# Altium project PoC_PCB.PrjPcb
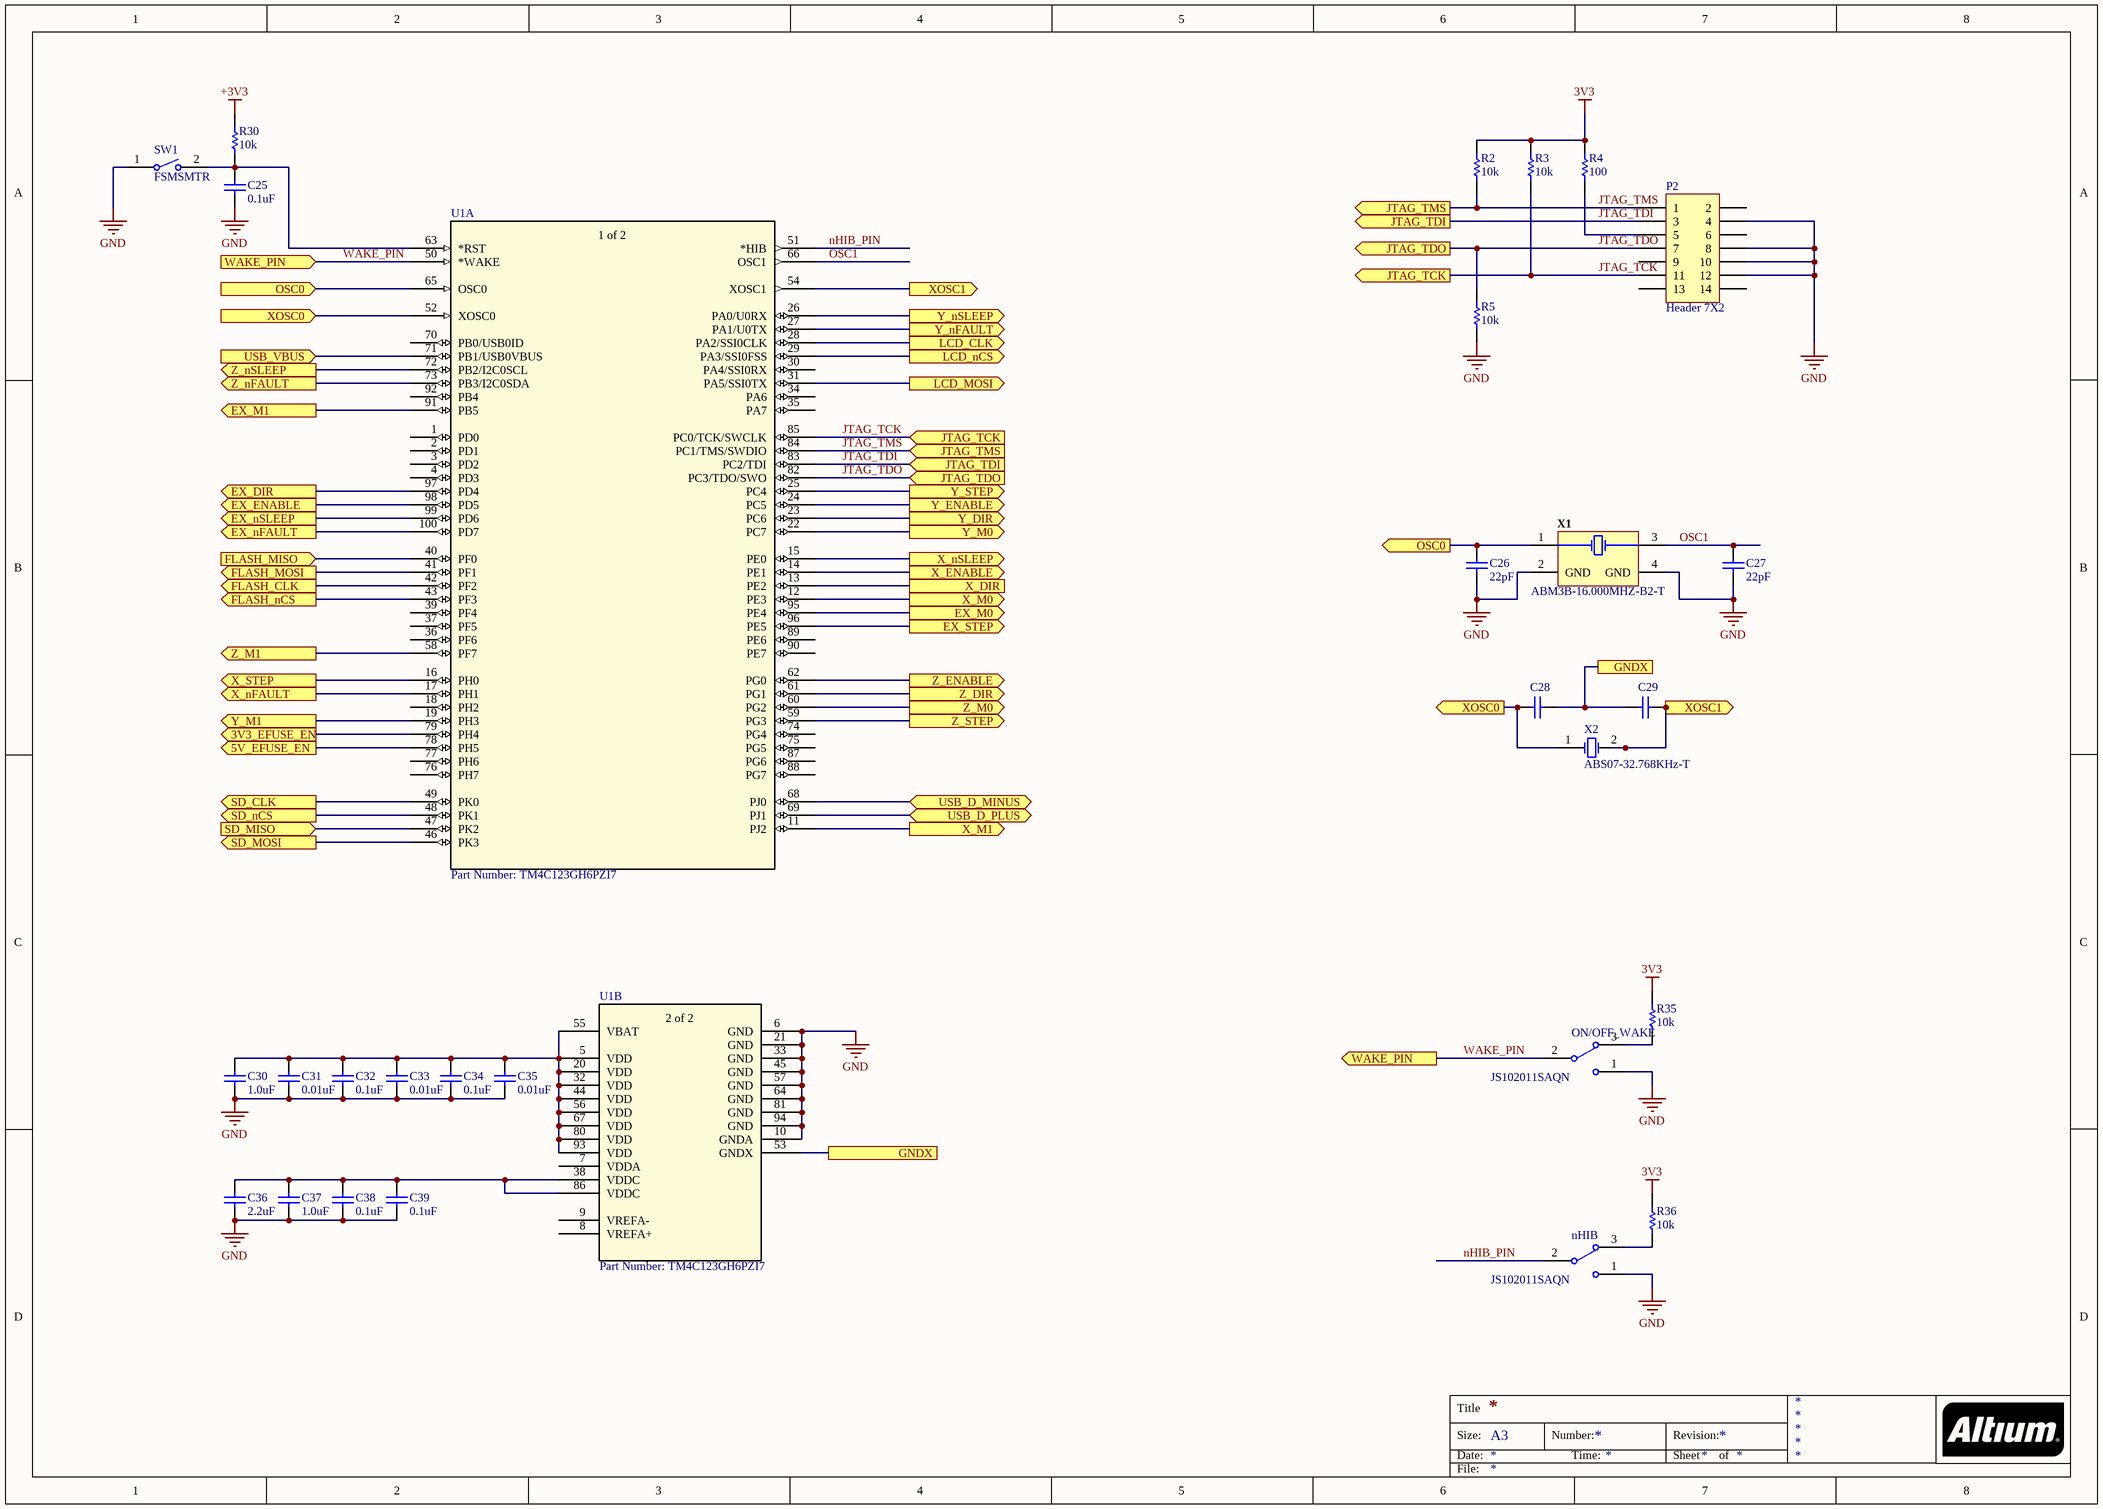
[diagram p0: MCU.SchDoc]
6 sheets, 123 parts. Net scope: flat (ports and power ports of the same name join across sheets).
Board file: PoC.PcbDoc
Sheets:
  MCU.SchDoc
  Memory_USB.SchDoc
  Power.SchDoc
  X_Y_Motor_Drivers.SchDoc
  Z_Extruder_Motor_Drivers.SchDoc
  LCD.SchDoc

## Sheet MCU.SchDoc
size A3

### Parts
C25  0.1uF  [CAPC1608X90X35ML10T15]
C26  22pF  [CAPC1608X90X35ML10T15]
C27  22pF  [CAPC1608X90X35ML10T15]
C28  GRM1885C1H120JA01D  [CAPC1608X90X35ML10T15]  (value not drawn)
C29  GRM1885C1H120JA01D  [CAPC1608X90X35ML10T15]  (value not drawn)
C30  1.0uF  [CAPC1608X60X35NL10T15]
C31  0.01uF  [CAPC1608X87X35ML15T15]
C32  0.1uF  [CAPC1608X90X35ML10T15]
C33  0.01uF  [CAPC1608X87X35ML15T15]
C34  0.1uF  [CAPC1608X90X35ML10T15]
C35  0.01uF  [CAPC1608X87X35ML15T15]
C36  2.2uF  [CAPC1608X90X35ML10T15]
C37  1.0uF  [CAPC1608X60X35NL10T15]
C38  0.1uF  [CAPC1608X90X35ML10T15]
C39  0.1uF  [CAPC1608X90X35ML10T15]
nHIB  JS102011SAQN  [CKCP-JS102011SAQN-3_V]
ON/OFF_WAKE  JS102011SAQN  [CKCP-JS102011SAQN-3_V]
P2  Header 7X2  [HDR2X7]
R2  10k  [RESC1608X55X30LL15T15]
R3  10k  [RESC1608X55X30LL15T15]
R4  100  [RESC1608X55X30LL15T15]
R5  10k  [RESC1608X55X30LL15T15]
R30  10k  [RESC1608X55X30LL15T15]
R35  10k  [RESC1608X55X30LL15T15]
R36  10k  [RESC1608X55X30LL15T15]
SW1  FSMSMTR  [TECO-FSMSMTR_V]
U1  Part Number: TM4C123GH6PZI7  [PZ100]  (parts A,B of 2)
X1  ABM3B-16.000MHZ-B2-T  [ABRA-ABM3B-4_V]
X2  ABS07-32.768KHz-T  [ABRA-ABS07-2_V]

### Ports
3V3_EFUSE_EN (out), 5V_EFUSE_EN (out), EX_DIR (out), EX_ENABLE (out), EX_M0 (out), EX_M1 (out), EX_nFAULT (out), EX_nSLEEP (out), EX_STEP (out), FLASH_CLK (out), FLASH_MISO (in), FLASH_MOSI (out), FLASH_nCS (out), GNDX, JTAG_TCK (in), JTAG_TCK (out), JTAG_TDI (in), JTAG_TDI (out), JTAG_TDO (in), JTAG_TDO (out), JTAG_TMS (in), JTAG_TMS (out), LCD_CLK (out), LCD_MOSI (out), LCD_nCS (out), OSC0 (in), OSC0 (out), SD_CLK (out), SD_MISO (in), SD_MOSI (out), SD_nCS (out), USB_D_MINUS (bidir), USB_D_PLUS (bidir), USB_VBUS (in), WAKE_PIN (in), WAKE_PIN (out), X_DIR, X_ENABLE (out), X_M0 (out), X_M1 (out), X_nFAULT (out), X_nSLEEP (out), X_STEP (out), XOSC0 (in), XOSC0 (out), XOSC1 (out), Y_DIR (out), Y_ENABLE (out), Y_M0 (out), Y_M1 (out), Y_nFAULT (out), Y_nSLEEP (out), Y_STEP (out), Z_DIR (out), Z_ENABLE (out), Z_M0 (out), Z_M1 (out), Z_nFAULT (out), Z_nSLEEP (out), Z_STEP (out)

### Nets
3V3: R2.2 R3.2 R4.2 R35.2 R36.2
+3V3: R30.2
GND: C25.1 C26.1 C27.1 C30.1 C31.1 C32.1 C33.1 C34.1 C35.1 C36.1 C37.1 C38.1 C39.1 nHIB.1 ON/OFF_WAKE.1 P2.4 P2.8 P2.10 P2.12 R5.1 SW1.1 U1.6(GND) U1.10(GNDA) U1.21(GND) U1.33(GND) U1.45(GND) U1.57(GND) U1.64(GND) U1.81(GND) U1.94(GND) X1.2(GND) X1.4(GND)
EX~{_}SLEEP: U1.99(PD6) ; port EX_nSLEEP
EX_DIR: U1.97(PD4) ; port EX_DIR
EX_ENABLE: U1.98(PD5) ; port EX_ENABLE
EX_M0: U1.95(PE4) ; port EX_M0
EX_M1: U1.91(PB5) ; port EX_M1
EX_nFAULT: U1.100(PD7) ; port EX_nFAULT
EX_STEP: U1.96(PE5) ; port EX_STEP
FLASH_Clk: U1.42(PF2) ; port FLASH_CLK
FLASH_MISO: U1.40(PF0) ; port FLASH_MISO
FLASH_MOSI: U1.41(PF1) ; port FLASH_MOSI
FLASH_nCS: U1.43(PF3) ; port FLASH_nCS
JTAG_TCK: P2.11 R3.1 U1.85(PC0/TCK/SWCLK) ; port JTAG_TCK
JTAG_TDI: P2.3 U1.83(PC2/TDI) ; port JTAG_TDI
JTAG_TDO: P2.7 R5.2 U1.82(PC3/TDO/SWO) ; port JTAG_TDO
JTAG_TMS: P2.1 R2.1 U1.84(PC1/TMS/SWDIO) ; port JTAG_TMS
nHIB_PIN: nHIB.2 U1.51(*HIB)
OSC1: C27.2 U1.66(OSC1) X1.3(X2)
SD_Clock: U1.49(PK0) ; port SD_CLK
SD_Data_In: U1.46(PK3) ; port SD_MOSI
SD_Data_Out: U1.47(PK2) ; port SD_MISO
SD_nCS: U1.48(PK1) ; port SD_nCS
WAKE_PIN: ON/OFF_WAKE.2 U1.50(*WAKE) ; port WAKE_PIN
X~{_}SLEEP: U1.15(PE0) ; port X_nSLEEP
X_DIR: U1.13(PE2) ; port X_DIR
X_ENABLE: U1.14(PE1) ; port X_ENABLE
X_M0: U1.12(PE3) ; port X_M0
X_M1: U1.11(PJ2) ; port X_M1
X_nFAULT: U1.17(PH1) ; port X_nFAULT
X_STEP: U1.16(PH0) ; port X_STEP
Y~{_}SLEEP: U1.26(PA0/U0RX) ; port Y_nSLEEP
Y_DIR: U1.23(PC6) ; port Y_DIR
Y_ENABLE: U1.24(PC5) ; port Y_ENABLE
Y_M0: U1.22(PC7) ; port Y_M0
Y_M1: U1.19(PH3) ; port Y_M1
Y_nFAULT: U1.27(PA1/U0TX) ; port Y_nFAULT
Y_STEP: U1.25(PC4) ; port Y_STEP
Z~{_}SLEEP: U1.72(PB2/I2C0SCL) ; port Z_nSLEEP
Z_DIR: U1.61(PG1) ; port Z_DIR
Z_ENABLE: U1.62(PG0) ; port Z_ENABLE
Z_M0: U1.60(PG2) ; port Z_M0
Z_M1: U1.58(PF7) ; port Z_M1
Z_nFAULT: U1.73(PB3/I2C0SDA) ; port Z_nFAULT
Z_STEP: U1.59(PG3) ; port Z_STEP
NetC25_2: C25.2 R30.1 SW1.2 U1.63(*RST)
NetC26_2: C26.2 U1.65(OSC0) X1.1(X1) ; port OSC0
NetC28_1: C28.1 U1.52(XOSC0) X2.1(X1) ; port XOSC0
NetC28_2: C28.2 C29.1 U1.53(GNDX) ; port GNDX
NetC29_2: C29.2 U1.54(XOSC1) X2.2(X2) ; port XOSC1
NetC30_2: C30.2 C31.2 C32.2 C33.2 C34.2 C35.2 U1.5(VDD) U1.20(VDD) U1.32(VDD) U1.44(VDD) U1.55(VBAT) U1.56(VDD) U1.67(VDD) U1.80(VDD) U1.93(VDD)
NetC36_2: C36.2 C37.2 C38.2 C39.2 U1.38(VDDC) U1.86(VDDC)
NetJ1_2: U1.68(PJ0) ; port USB_D_MINUS
NetJ1_3: U1.69(PJ1) ; port USB_D_PLUS
NetLCD_J2_1: U1.29(PA3/SSI0FSS) ; port LCD_nCS
NetLCD_J2_3: U1.28(PA2/SSI0CLK) ; port LCD_CLK
NetLCD_J2_4: U1.31(PA5/SSI0TX) ; port LCD_MOSI
NetnHIB_3: nHIB.3 R36.1
NetON/OFF_WAKE_3: ON/OFF_WAKE.3 R35.1
NetP2_5: P2.5 R4.1
NetR31_1: U1.71(PB1/USB0VBUS) ; port USB_VBUS
NetU1_78: U1.78(PH5) ; port 5V_EFUSE_EN
NetU1_79: U1.79(PH4) ; port 3V3_EFUSE_EN

Not connected (* = marked no-connect by the designer): P2 2 6 9 13 14; U1 1(PD0) 2(PD1) 3(PD2) 4(PD3) 7(VDDA) 8(VREFA+) 9(VREFA-) 18(PH2) 30(PA4/SSI0RX) 34(PA6) 35(PA7) 36(PF6) 37(PF5) 39(PF4) 70(PB0/USB0ID) 74(PG4) 75(PG5) 76(PH7) 77(PH6) 87(PG6) 88(PG7) 89(PE6) 90(PE7) 92(PB4)

### Notes on the sheet
- Title
- Size:
- Date:
- A3
- Number:
- Time:
- Revision:
- Sheet
- of
- File:
- (in symbol TM4C123GH6PZI7, part A) 1 of 2
- (in symbol TM4C123GH6PZI7, part B) 2 of 2

### Library data of the parts
C25 C32 C34 C38 C39 = CMP-2100-03643-1: Chip Capacitor, 0.1 uF, +/- 10%, 50 V, -55 to 125 degC, 0603 (1608 Metric), RoHS, Tape and Reel; Manufacturer: Murata; Dielectric Material: Ceramic; Voltage Rating: 50V; Capacitance: 100nF; Dielectric: X7R; Insulation Resistance: 10GR; Case Code (Metric): 1608; Lead Free: LeadFree; Depth: 0.8mm; Number of Pins: 2; Radiation Hardening: No; Case/Package: 0603; Manufacturer URL: http://www.murata.com/; Packaging: TapeandReel; Length: 1.6mm; Contact Plating: Tin; Datasheet URL: http://psearch.en.murata.com/capacitor/product/GRM188R71H104KA93%23.pdf; Tolerance: 10%; Case Code (Imperial): 0603; Min Operating Temperature: -55degC; RoHSCompliant: true; Voltage: 50V; Termination: SMD/SMT; Mount: SurfaceMount; Material: Ceramic; Package Quantity: 1; Height: 0.8mm; Thickness: 0.035inch; REACH SVHC: NoSVHC; Max Operating Temperature: 125degC; Width: 0.8mm; Package Reference: 0603; Voltage Rating (DC): 50V; Datasheet Version: 42675.0; Package Description: 2-Pin Surface Mount Device, Body 1.6 x 0.8 mm
C26 C27 = CMP-2006-02602-1: Part Number: GRM1885C1H120JA01D; Manufacturer: Murata
C28 C29 = CMP-2006-02602-1: Manufacturer: Murata; Part Number: GRM1885C1H120JA01D
C30 C37 = CMP-2006-00116-1: Manufacturer: Murata; Part Number: GRM185R61C105KE44J
C31 C33 C35 = CMP-2006-03042-1: Part Number: C0603C103K4RACTU; Manufacturer: Kemet
C36 = CMP-2006-02836-1: Manufacturer: Murata; Part Number: GRM188R71A225KE15D
nHIB ON/OFF_WAKE = CMP-2000-06501-1: Sub-Miniature Slide Switch, SPDT, -40 to 85 degC, 3-Pin SMD, RoHS, Tape and Reel; Manufacturer: C&K Components; Electrical Life: 15000Cycles; Actuator Color: Black; Body Orientation: RightAngle; Minimum Insulation Resistance: 100MOhm; Contact Rating @ Voltage: 0.3@6VDCA; Actuator Style: SideSlide; Maximum DC Voltage Rating: 6V; COO: US; Actuator Material: Nylon4/6; Dielectric Strength: 500VAC; Maximum Contact Resistance: 70mOhm; Base Material: N/A; Mounting Technology: SurfaceMount; Switch Configuration: N/A; Package Reference: SMT; Package Description: 3-Pin Surface Mount Device, Body 9 x 3.6 mm, Height 3.5 mm; Mounting: SurfaceMount,GullWing; Part No: JS102011SAQN; Dimension: 9x4.3mm; Type: Sub-Miniature; Product Weight: N/A; Seal Location: N/A; Family: JS; ECCN: EAR99; Supplier: C&KComponents; Seal Description: N/A; Contact Plating: Silver; Pole Throw Configuration: SPDT; Packaging: TapeandReel; Manufacturer URL: http://www.ckswitches.com/; Datasheet URL: https://datasheet.ciiva.com/1532/js-9dec14-1532400.pdf; Maximum AC Voltage Rating: N/A; Mechanical Life: N/A; HTS: 8536509050; Datasheet Version: 12/2014; Housing Material: Nylon4/6; Contact Material: CopperAlloy; RoHS: Yes; Operating Temperature: -40to85C
P2 = Header 7X2: Header, 7-Pin, Dual row; LatestRevisionDate: 17-Jul-2002; LatestRevisionNote: Re-released for DXP Platform.; Publisher: Altium Limited
R2-R5 R30 R35 R36 = CMP-2000-00181-1: Part Number: ERJ-3EKF1002V; Manufacturer: Panasonic
SW1 = CMP-2000-07501-1: FSMSM Push Button Switch, 50 mA, -35 to 85 degC, 2-Pin SMD, RoHS, Tape and Reel; Manufacturer: TE Connectivity; Voltage Rating (DC): 24V; Electrical Life: 20000Cycles; Operating Force: 180gf; Switch Travel: 0.25mm; Contact Current Rating: 50mA; Case\/Package: SMD/SMT; Actuator Length: 1.07mm; Throw Configuration: SPST; Actuator Material: Polyamide; Contact Resistance: 100mOhm; Illumination Type: Illuminated; Max Voltage Rating (DC): 12V; Manufacturer URL: http://www.te.com/; Lead Free: LeadFree; Packaging: TapeandReel; Min Operating Temperature: -35degC; Mechanical Life: 20000Cycles; Mount: SurfaceMount; REACH SVHC: Unknown; Package Quantity: 1800; Package Reference: FSMSMTR; RoHSCompliant: true; Max Operating Temperature: 85degC; Orientation: Straight; ELV: Compliant; Datasheet URL: http://www.te.com/commerce/DocumentDelivery/DDEController?Action=showdoc&DocId=Customer+Drawing%7F1437566-3%7FC2%7Fpdf%7FEnglish%7FENG_CD_1437566-3_C2_1437566_3_1_c.dwg.pdf%7F1437566-4; Package Description: 2-Pin Surface Mount Device, Body 6 x 3.5 mm, Pitch 9.19 mm; Current Rating: 50mA; Contact Plating: Silver; Termination: GullWing; Datasheet Version: Rev. C2, 08/2014; Contact Material: Brass; Mounting Technology: SurfaceMount
U1 = TM4C123GH6PZI7: No Description Available; Built_By: EMA_UL_Team; Vendor: Texas Instruments; Manufacturer_Part_Number: TM4C123GH6PZI7; Copyright: Copyright (C) 2018 Accelerated Designs. All rights reserved; RefDes: RefDes; Type: DEV; Value: Value
X1 = CMP-1688-00003-1: Ceramic SMD Crystal, 16 MHz, +/- 20 ppm, 50 Ohm, -20 to 70 degC, 4-Pin SMD, RoHS, Tape and Reel; Current Rating: 1.82 A; Resistance: 0.033 Ohm; Tolerance: 30%; Shielding: Shielded; REACH SVHC: Unknown; RoHSCompliant: True; PackageReference: ABM3B; Mount: Surface Mount; Max Operating Temperature: 105degC; DatasheetVersion: Aug-15; Package Quantity: 500; PackageDescription: 4-Pin Surface Mount Device, Body 5 x 3.2 mm; ComponentLink2URL: http://www.abracon.com/Resonators/abm3b.pdf; Packaging: Tape and Reel; Height: 2.8 mm; ComponentLink1URL: http://www.abracon.com/; ComponentLink2Description: Datasheet; Length: 0.197 inch; ComponentLink1Description: Manufacturer URL; Case/Package: 5028; Width: 0.197 inch; Min Operating Temperature: -40degC
X2 = CMP-0447-00001-2: Crystal, 32.768 kHz, 12.5 pF, -40 to 85 degC, SMD Low Profile 3.2 x 1.5 x 0.9 mm, Tape and Reel; Manufacturer: Abracon; Q Value (Type): 30000; Operation Mode: Flexural Mode (Tuning Fork); Shunt Capacitance (C0): 0.9 to 1.2 pF; Load Capacitance (CL): 12.5 pF; Frequency Tolerance @+25degC: +/- 20 ppm; Drive Level (Type): 0.1 uW; Equivalent Series Resistance (R1): 70 Kohm; Insulation Resistance (Min): 500 Mohm; ComponentLink3URL: http://www.abracon.com/Resonators/ABS07.pdf; PackageDescription: 2-Pin Hand Drawn, Body 3.2x1.5mm, Pitch 2.5mm; Operating Temperature: -40 to 85 degC; ComponentLink2URL: http://www.abracon.com/Resonators/ABS07.pdf; PackageReference: ABS07-2; ComponentLink3Description: Package Specification; ComponentLink1Description: Manufacturer URL; DatasheetVersion: 04.03.13; Mounting Technology: Surface Mount; ComponentLink2Description: Datasheet; ComponentLink1URL: http://www.abracon.com/; PartNumber: ABS07-32.768KHz-T; Packing: Tape and Reel; Frequency: 32.768 kHz

## Sheet Memory_USB.SchDoc
size A
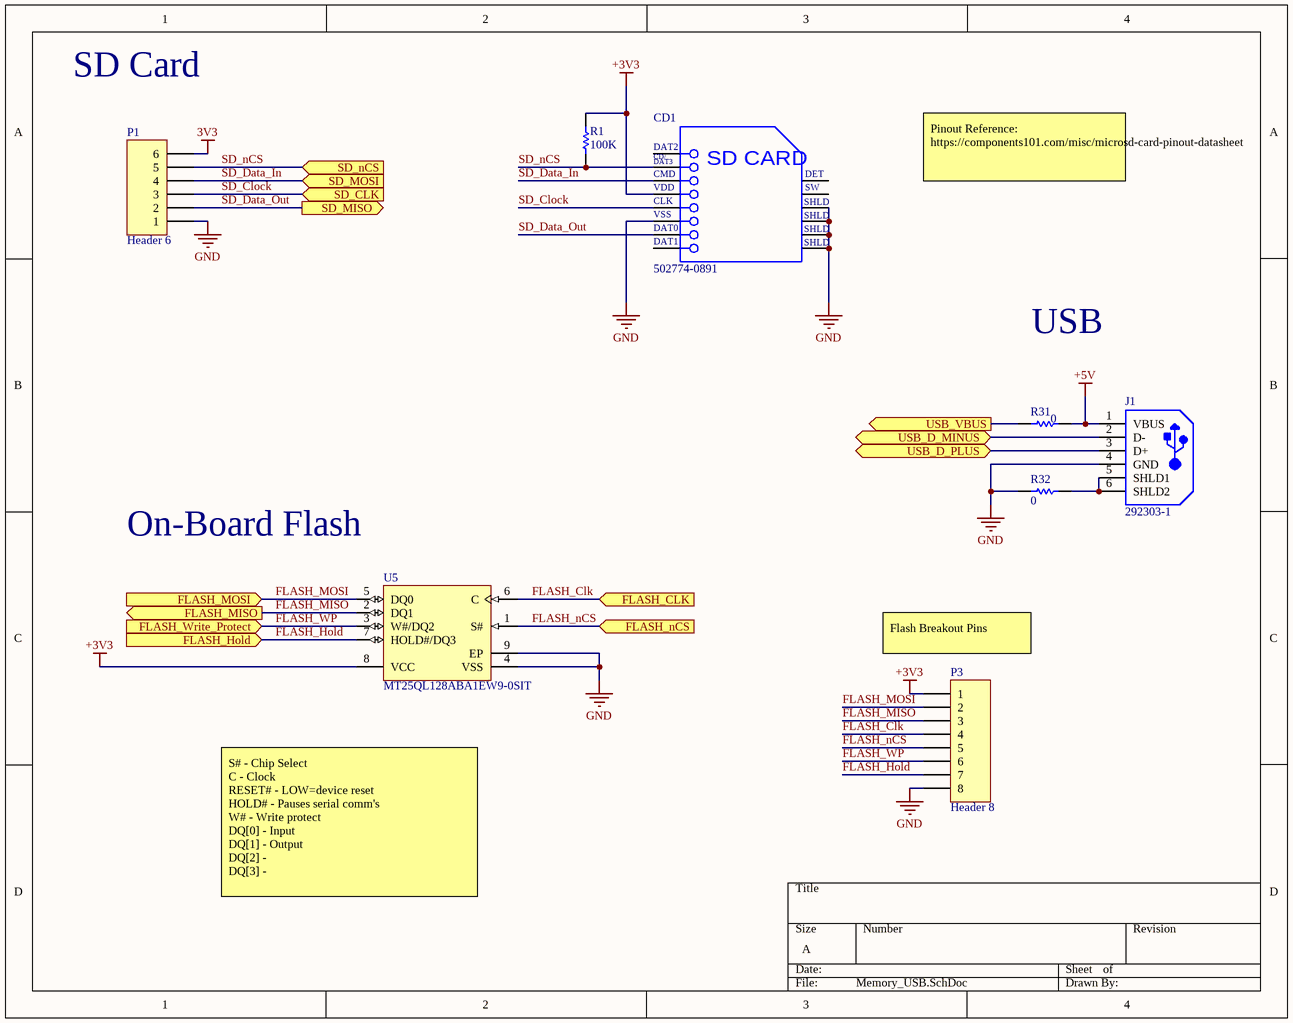
[diagram p1: Memory_USB.SchDoc]

### Parts
CD1  502774-0891  [MOLX-502774-0891_V]
J1  292303-1  [TE-292303-1_V]
P1  Header 6  [HDR1X6]
P3  Header 8  [HDR1X8]
R1  100K  [RESC1608X55X25ML10T15]
R31  0  [RESC1608X55X25ML10T15]
R32  0  [RESC1608X55X25ML10T15]
U5  MT25QL128ABA1EW9-0SIT  [MICT-W9-8_L]

### Ports
FLASH_CLK (in), FLASH_Hold (in), FLASH_MISO (out), FLASH_MOSI (in), FLASH_nCS (in), FLASH_Write_Protect (in), SD_CLK (in), SD_MISO (out), SD_MOSI (in), SD_nCS (in), USB_D_MINUS (bidir), USB_D_PLUS (bidir), USB_VBUS (out)

### Nets
3V3: P1.6
+3V3: CD1.4(VDD) P3.1 R1.2 U5.8(VCC)
+5V: J1.1(VBUS) R31.2
GND: CD1.6(VSS) CD1.11(SHLD) CD1.12(SHLD) CD1.13(SHLD) CD1.14(SHLD) J1.4(GND) P1.1 P3.8 R32.1 U5.4(VSS) U5.9(EP)
FLASH_Clk: P3.4 U5.6(C) ; port FLASH_CLK
FLASH_Hold: P3.7 U5.7(HOLD#/DQ3) ; port FLASH_Hold
FLASH_MISO: P3.3 U5.2(DQ1) ; port FLASH_MISO
FLASH_MOSI: P3.2 U5.5(DQ0) ; port FLASH_MOSI
FLASH_nCS: P3.5 U5.1(S#) ; port FLASH_nCS
FLASH_WP: P3.6 U5.3(W#/DQ2) ; port FLASH_Write_Protect
SD_Clock: CD1.5(CLK) P1.3 ; port SD_CLK
SD_Data_In: CD1.3(CMD) P1.4 ; port SD_MOSI
SD_Data_Out: CD1.7(DAT0) P1.2 ; port SD_MISO
SD_nCS: CD1.2(CD/DAT3) P1.5 R1.1 ; port SD_nCS
NetJ1_2: J1.2(D-) ; port USB_D_MINUS
NetJ1_3: J1.3(D+) ; port USB_D_PLUS
NetJ1_5: J1.5(SHLD1) J1.6(SHLD2) R32.2
NetR31_1: R31.1 ; port USB_VBUS

Not connected (* = marked no-connect by the designer): CD1 1(DAT2) 8(DAT1) 9(DETECT) 10(SWITCH)

### Notes on the sheet
- SD Card
- Pinout Reference: https://components101.com/misc/microsd-card-pinout-datasheet
- USB
- On-Board Flash
- (near P3) Flash Breakout Pins
- S# - Chip Select
  C - Clock
  RESET# - LOW=device reset
  HOLD# - Pauses serial comm's
  W# - Write protect
  DQ[0] - Input
  DQ[1] - Output
  DQ[2] -
  DQ[3] -
- (in symbol CMP-2000-05248-1) CD/; DAT3; SD CARD; DET; SW

### Library data of the parts
CD1 = CMP-2000-05248-1: Micro SD Memory Card Connector, 0.5 A, 10 V (DC), -25 to 85 degC, 8-Pin SMT, RoHS, Tape and Reel; Manufacturer: Molex; 3D Model: 502774-0891.stp; Online Catalog: microSD™Series; Number of Positions: 10(8+2); Card Type: SecureDigital-microSD™; Insertion, Removal Method: PushIn,PushOut; Other Names: WM24066DKR; Connector Type: ConnectorandEjector; Features: Switch; Family: MemoryConnectors-PCCardSockets; Manufacturer URL: http://www.molex.com/; Mounting Type: SurfaceMount,RightAngle; Contact Finish Thickness: 20µin(0.51µm); Standard Package: 1; Series: 502774; Ejector Side: -; Datasheet Version: Rev. D, 04/2004; Category: Connectors,Interconnects; Contact Finish: Gold; Datasheet URL: https://datasheet.ciiva.com/1104/1499551-1104671.pdf; RoHS Information: 502774-0891CertofCompliance; Mounting Feature: Reverse-Bottom; Packaging: Digi-Reel; Height Above Board: 0.071"(1.80mm); Catalog Drawings: 502774-0891
J1 = CMP-2000-05404-1: 1 Port Right Angle Through Hole Mount Female Type A USB Connector, 4 Position, -55 to 85 degC, RoHS, Tube; Manufacturer: TE Connectivity; Contact Termination Type: Solder; No. of Contacts: 4; Connector Mounting: PCB; SVHC: NoSVHC(16-Jun-2014); Gender: Receptacle; Connector Type: USBA; Package Description: 4-Pin Through Hole Device, Body 14 x 13.13 mm, Pitch 2.5 mm; Contact Plating: Gold; Package Reference: 292303-1; Contact Material: Copper; Datasheet URL: http://www.farnell.com/cad/1653030.pdf; Datasheet Version: Feb-12; Manufacturer URL: http://www.te.com/
P1 = Header 6: Header, 6-Pin; LatestRevisionDate: 17-Jul-2002; LatestRevisionNote: Re-released for DXP Platform.; Publisher: Altium Limited
P3 = Header 8: Header, 8-Pin; LatestRevisionDate: 17-Jul-2002; LatestRevisionNote: Re-released for DXP Platform.; Publisher: Altium Limited
R1 = CMP-2100-03662-1: Chip Resistor, 100 KOhm, +/- 1%, 0.1 W, -55 to 155 degC, 0603 (1608 Metric), RoHS, Tape and Reel; Manufacturer: Yageo; Power Rating: 100mW; Voltage Rating: 50V; Temperature Coefficient: 100ppm/degreesC; Datasheet Version: Rev. 5, 10/2016; Height: 0.45mm; Lead Free: LeadFree; Manufacturer URL: http://www.yageo.com/; Package Reference: 0603; Depth: 0.8mm; RoHSCompliant: true; Composition: ThickFilm; Military Standard: Not; Resistance: 100KOhm; Case/Package: 0603; Packaging: TapeandReel; Case Code (Imperial): 0603; Voltage Rating (DC): 50V; Case Code (Metric): 1608; Tolerance: 1%; Termination: SMD/SMT; Min Operating Temperature: -55degC; Number of Pins: 2; Length: 1.6mm; Width: 0.8mm; Datasheet URL: http://www.yageo.com/NewPortal/yageodocoutput?fileName=/pdf/R-Chip/PYu-RC_Group_51_RoHS_L_5.pdf; Package Description: 2-Pin Surface Mount Device, Body 1.6 x 0.8 mm; Max Operating Temperature: 155degC; REACH SVHC: NoSVHC
R31 R32 = CMP-2100-03667-1: Chip Resistor, 0 Ohm, +/- 5%, 0.1 W, -55 to 155 degC, 0603 (1608 Metric), RoHS, Tape and Reel; Manufacturer: Yageo; Temperature Coefficient: 200ppm/degreesC; Voltage Rating: 50V; Power Rating: 100mW; Resistance: 0mOhm; Width: 0.8mm; Max Operating Temperature: 155degC; Tolerance: 5%; Package Reference: 0603; Height: 0.45mm; Depth: 0.8mm; Package Description: 2-Pin Surface Mount Device, Body 1.6 x 0.8 mm; Termination: SMD/SMT; Package Quantity: 5000; Case/Package: 0603; Case Code (Imperial): 0603; Radiation Hardening: No; Number of Pins: 2; Length: 1.6mm; Lead Free: LeadFree; Voltage Rating (DC): 50V; Military Standard: Not; Datasheet URL: http://www.yageo.com/NewPortal/yageodocoutput?fileName=/pdf/R-Chip/PYu-RC_Group_51_RoHS_L_5.pdf; Manufacturer URL: http://www.yageo.com/; Packaging: TapeandReel; Case Code (Metric): 1608; Min Operating Temperature: -55degC; Composition: ThickFilm; RoHSCompliant: true; Contact Plating: Tin; Datasheet Version: Rev. 5, 10/2016; REACH SVHC: NoSVHC
U5 = CMP-2000-07470-1: Micron Serial NOR Flash Memory, 2.7 to 3.6 V, 128 Mb, -40 to 85 degC, 8-Pin W-PDFN (W9), RoHS, Tape and Reel; Package Reference: W9; Datasheet URL: https://www.micron.com/~/media/documents/products/data-sheet/nor-flash/serial-nor/mt25q/die-rev-a/mt25q_qlhs_l_128_aba_0.pdf; Package Description: 8-Pin Plastic Dual Flat No-lead Package, Body 8 x 6 mm, Pitch 1.27 mm; RoHSCompliant: false; Datasheet Version: Rev. I , 09/2016; Mounting Technology: SurfaceMount; Manufacturer URL: http://www.micron.com/; Manufacturer: Micron

## Sheet Power.SchDoc
size A
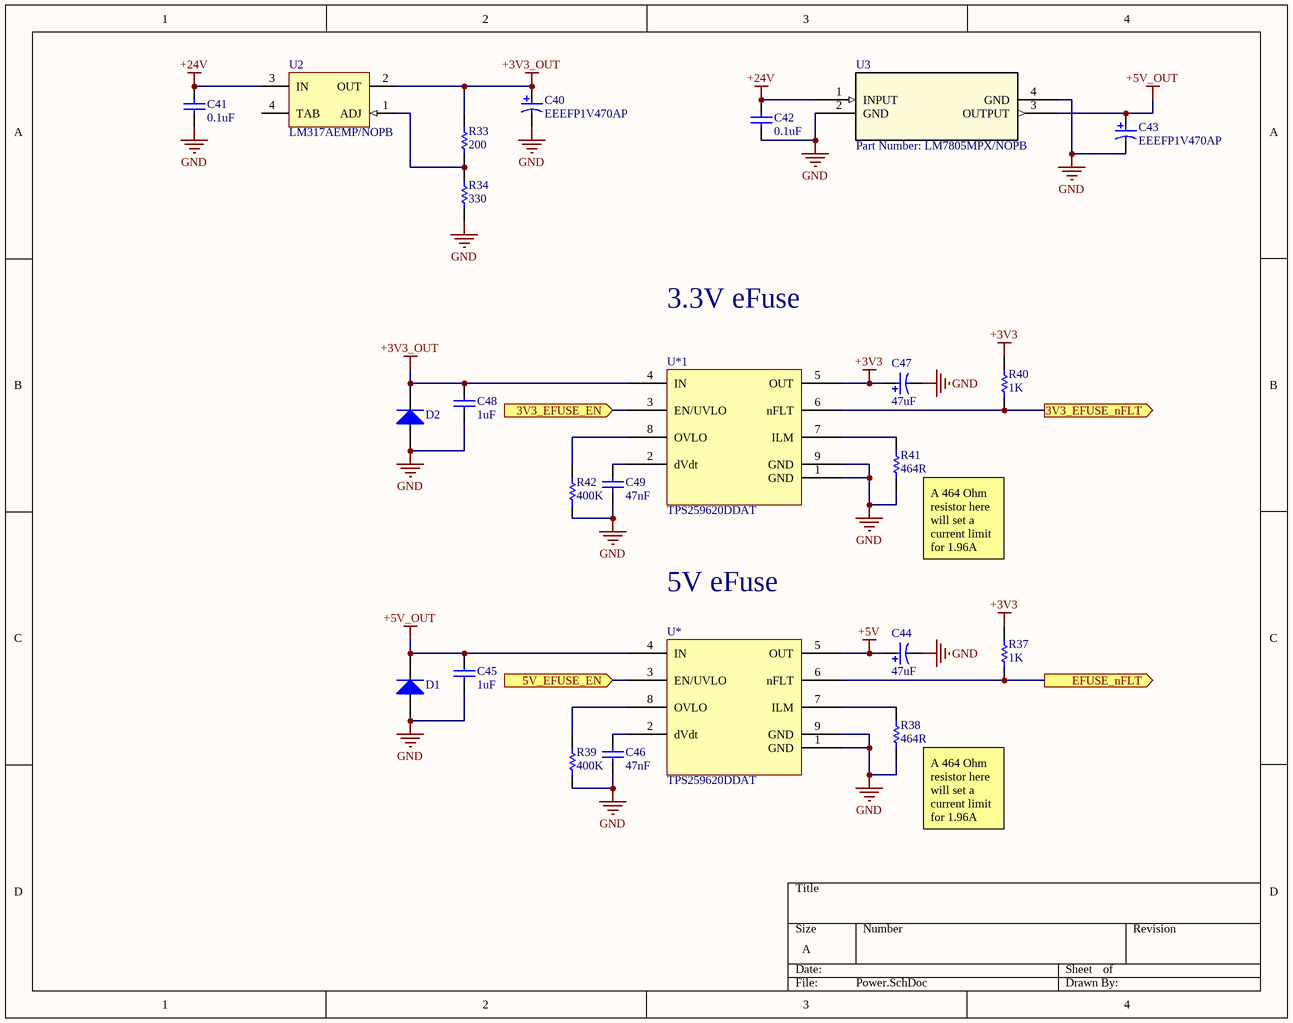
[diagram p2: Power.SchDoc]

### Parts
C40  EEEFP1V470AP  [PNSC-FP-V-D_V]
C41  0.1uF  [CAPC1608X90X35ML10T15]
C42  0.1uF  [CAPC1608X90X35ML10T15]
C43  EEEFP1V470AP  [PNSC-FP-V-D_V]
C44  47uF  [PNSC-FP-V-D_V]
C45  1uF  [CAPC1608X90X20LL10]
C46  47nF  [CAPC1608X90X35ML10T15]
C47  47uF  [PNSC-FP-V-D_V]
C48  1uF  [CAPC1608X90X20LL10]
C49  47nF  [CAPC1608X90X35ML10T15]
D1  SMAJ5.0A-E3/61  [VISH-DO-214AC-2_M]  (value not drawn)
D2  SMAJ5.0A-E3/61  [VISH-DO-214AC-2_M]  (value not drawn)
R33  200  [RESC1608X55X30NL20T20]
R34  330  [RESC1608X55X30NL15T15]
R37  1K  [RESC1608X55X30LL15T15]
R38  464R  [RESC1608X55X30LL15T15]
R39  400K  [RESC1608X55X30LL15T15]
R40  1K  [RESC1608X55X30LL15T15]
R41  464R  [RESC1608X55X30LL15T15]
R42  400K  [RESC1608X55X30LL15T15]
U2  LM317AEMP/NOPB  [DCY0004A_L]
U3  Part Number: LM7805MPX/NOPB  [DCY4]
U*  TPS259620DDAT
U*1  TPS259620DDAT

### Ports
3V3_EFUSE_EN (in), 3V3_EFUSE_nFLT (out), 5V_EFUSE_EN (in), EFUSE_nFLT (out)

### Nets
+3V3: C47.1 R37.2 R40.2 U*1.5(OUT)
+3V3_OUT: C40.1 C48.2 D2.1(K) R33.2 U2.2(OUT) U*1.4(IN)
+5V: C44.1 U*.5(OUT)
+5V_OUT: C43.1 C45.2 D1.1(K) U3.3(OUTPUT) U*.4(IN)
+24V: C41.2 C42.2 U2.3(IN) U3.1(INPUT)
GND: C40.2 C41.1 C42.1 C43.2 C44.2 C45.1 C46.1 C47.2 C48.1 C49.1 D1.2(A) D2.2(A) R34.1 R38.1 R39.1 R41.1 R42.1 U3.2(GND) U3.4(GND) U*.1(GND) U*.9(GND) U*1.1(GND) U*1.9(GND)
NetC46_2: C46.2 U*.2(dVdt)
NetC49_2: C49.2 U*1.2(dVdt)
NetR33_1: R33.1 R34.2 U2.1(ADJ)
NetR37_1: R37.1 U*.6(nFLT) ; port EFUSE_nFLT
NetR38_2: R38.2 U*.7(ILM)
NetR39_2: R39.2 U*.8(OVLO)
NetR40_1: R40.1 U*1.6(nFLT) ; port 3V3_EFUSE_nFLT
NetR41_2: R41.2 U*1.7(ILM)
NetR42_2: R42.2 U*1.8(OVLO)
NetU1_78: U*.3(EN/UVLO) ; port 5V_EFUSE_EN
NetU1_79: U*1.3(EN/UVLO) ; port 3V3_EFUSE_EN

Not connected (* = marked no-connect by the designer): U2 4(TAB)

### Notes on the sheet
- 3.3V eFuse
- (near R41) A 464 Ohm resistor here will set a current limit for 1.96A
- 5V eFuse
- (near R38) A 464 Ohm resistor here will set a current limit for 1.96A

### Library data of the parts
C40 C43 C44 C47 = CMP-2000-06216-1: Aluminum Electrolytic Capacitor, 47 uF, +/- 20%, 35 V, 2-Pin SMD (Size Code D), -55 to 105 degC, RoHS, Tape and Reel; Manufacturer: Panasonic; Lifetime@Temperature: 2000Hrs@105°C; Capacitance: 47µF; Type: Can; Rated Voltage: 35V; Ripple Current: 300mA; ESR (Equivalent Series Resistance): 0.26O; Package Reference: FP-V-D; Package Description: 2-Pin Electrolytic Aluminum Capacitor, Body 6.6 x 6.6 mm; Datasheet URL: http://industrial.panasonic.com/cdbs/www-data/pdf/RDE0000/ABA0000C1184.pdf; Series: FP; Operating Temp Range: -55to+105°C; Operating Temp-Max: 105°C; Datasheet Version: 03/2016; Manufacturer URL: http://www.panasonic.com/; Package URL: http://industrial.panasonic.com/cdbs/www-data/pdf/RDE0000/DME0000COL48.pdf; Case Size/Dimension: Ø6.3x5.8mm; Mounting Technology: SurfaceMount
C41 C42 = CMP-2100-03643-1: as C25 on sheet MCU; Case Code (Metric): 1608; Lead Free: LeadFree; Depth: 0.8mm; Number of Pins: 2; Radiation Hardening: No; Case/Package: 0603; Manufacturer URL: http://www.murata.com/; Packaging: TapeandReel; Length: 1.6mm; Contact Plating: Tin; Datasheet URL: http://psearch.en.murata.com/capacitor/product/GRM188R71H104KA93%23.pdf; Tolerance: 10%; Case Code (Imperial): 0603; Min Operating Temperature: -55degC; RoHSCompliant: true; Voltage: 50V; Termination: SMD/SMT; Mount: SurfaceMount; Material: Ceramic; Package Quantity: 1; Height: 0.8mm; Thickness: 0.035inch; REACH SVHC: NoSVHC; Max Operating Temperature: 125degC; Width: 0.8mm; Package Reference: 0603; Voltage Rating (DC): 50V; Datasheet Version: 42675.0; Package Description: 2-Pin Surface Mount Device, Body 1.6 x 0.8 mm
C45 C48 = CMP-2000-06025-1: Chip Capacitor, 1 uF, +/- 10%, 50 V, -55 to 85 degC, 0603 (1608 Metric), RoHS, Tape and Reel; Manufacturer: TDK; PCN Part Number: MLCCPartNumberChange30/Nov/2012; Other Names: 445-7468-6; Online Catalog: CSeries,GeneralPurpose; Capacitance: 1µF; Product Training Modules: CSeriesGeneralApplicationsSEAT,CCV,andTVCLDesignToolsGuidetoReplacinganElectrolyticCapacitorwithanMLCC; Voltage - Rated: 50V; Design Resources: 20WNon-IsolatedBuckLEDDriverUsingPLLNK460KG; Temperature Coefficient: X5R; Series: C; Datasheet Version: 08/2016; Package Description: 2-Pin Surface Mount Device, Body 1.6 x 0.8 mm; Mounting Technology: SurfaceMount; Features: -; Size / Dimension: 0.063"Lx0.031"W(1.60mmx0.80mm); Lead Spacing: -; Operating Temperature: -55°C~85°C; Tolerance: ±10%; Height - Seated (Max): -; Mounting Type: SurfaceMount,MLCC; Ratings: -; Standard Package: 1; Applications: GeneralPurpose; Datasheet URL: https://product.tdk.com/info/en/catalog/datasheets/mlcc_commercial_general_en.pdf; Category: Capacitors; Lead Style: -; Packaging: Digi-Reel®; RoHS Information: RoHSCertificate-MLCC; Package / Case: 0603(1608Metric); Package Reference: 0603; Manufacturer URL: http://www.tdk.com/; Thickness (Max): 0.035"(0.90mm); Family: CeramicCapacitors
C46 C49 = CMP-2006-02927-1: Manufacturer: Murata; Part Number: GRM188R71H473KA61D
D1 D2 = CMP-0548-00235-2: Transient Voltage Suppressor, 6.40 to 231 V, 5 V Stand-off Voltage, Uni-Directional, -55 to 155 degC, 2-pin DO-214AC, Pb-Free, Tape and Reel; Manufacturer: Vishay Semiconductor; ID (uA): 800; VBR Uni-Directional (V): 6.4 to 231; IFSM: 40 A; PPPM (W): 400, 300; VWM (V): 5; PackageReference: DO-214AC-2; ComponentLink2URL: http://www.vishay.com/docs/88390/smaj50a.pdf; Operating Junction and Storage Temperature Range: -55 to 150 degC; ComponentLink1Description: Manufacturer URL; PackageDescription: 2-Pin DO-214AC (SMA), Body 4.245 x 2.665 mm; ComponentLink2Description: Datasheet; ComponentLink3URL: http://www.vishay.com/docs/88390/smaj50a.pdf; ComponentLink3Description: Package Specification; RoHS: TRUE; PartNumber: SMAJ5.0A-E3/61; Mounting Technology: Surface Mount; ComponentLink1URL: http://www.vishay.com/; Packing: Tape and Reel; DatasheetVersion: 12/8/2013
R33 = CMP-2000-00944-1: Manufacturer: Panasonic; Part Number: ERA3AEB201V
R34 = CMP-2000-00435-1: Part Number: ERJ3EKF3300V; Manufacturer: Panasonic
R37-R42 = CMP-2000-00411-1: Manufacturer: Panasonic; Part Number: ERJ-3EKF3000V
U2 = CMP-0062-01710-3: 3-Terminal Adjustable Regulator, 4-pin SOT-223, Pb-Free; Manufacturer: Texas Instruments; PowerWise: N; CompType: LDO IC; PackageTopMarking: XYTT*N07A; PackageDescription: Molded SOT-223, 6.50 x 3.56 x 1.6mm Body, 4 Lead, 2.3mm Pitch; Code_JEDEC: TO-261-AA; RoHS: Y; ComponentLink1URL: http://www.ti.com/general/docs/lit/getliterature.tsp?genericPartNumber=LM317-N&fileType=pdf; PackageReference: DCY0004A; ComponentLink1Description: Datasheet URL; Code_IPC: SOT223-4; PinCount: 4
U3 = LM7805MPX/NOPB: No Description Available; Vendor: Texas Instruments; Built_By: EMA_Jessica; Manufacturer_Part_Number: LM7805MPX/NOPB; Copyright: Copyright (C) 2018 Accelerated Designs. All rights reserved; RefDes: RefDes; Type: DEV; Value: Value

## Sheet X_Y_Motor_Drivers.SchDoc
size A
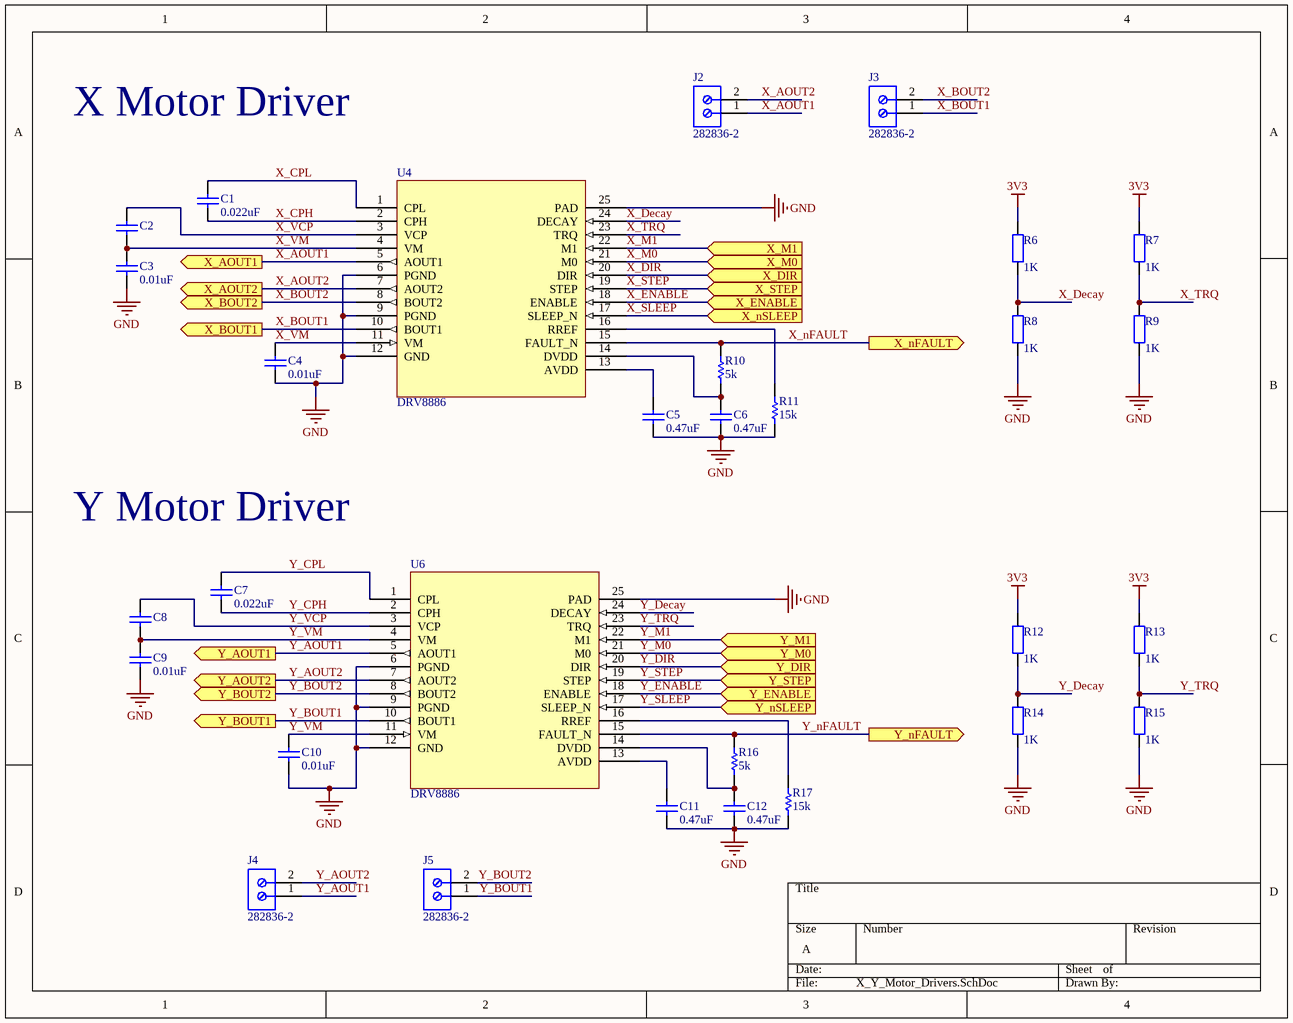
[diagram p3: X_Y_Motor_Drivers.SchDoc]

### Parts
C1  0.022uF  [CAPC1608X87X35ML15T15]
C2  0.22uF  [TDK-C1608-2_A_M]  (value not drawn)
C3  0.01uF  [CAPC1608X87X35LL15T15]
C4  0.01uF  [CAPC1608X87X35LL15T15]
C5  0.47uF  [CAPC1608X90X35ML15T15]
C6  0.47uF  [CAPC1608X90X35ML15T15]
C7  0.022uF  [CAPC1608X87X35ML15T15]
C8  0.22uF  [TDK-C1608-2_A_M]  (value not drawn)
C9  0.01uF  [CAPC1608X87X35LL15T15]
C10  0.01uF  [CAPC1608X87X35LL15T15]
C11  0.47uF  [CAPC1608X90X35ML15T15]
C12  0.47uF  [CAPC1608X90X35ML15T15]
J2  282836-2  [TECO-282836-2_V]
J3  282836-2  [TECO-282836-2_V]
J4  282836-2  [TECO-282836-2_V]
J5  282836-2  [TECO-282836-2_V]
R6  value 1K  [AXIAL-0.4]  (hidden comment: ?)
R7  value 1K  [AXIAL-0.4]  (hidden comment: ?)
R8  value 1K  [AXIAL-0.4]  (hidden comment: Res2)
R9  value 1K  [AXIAL-0.4]  (hidden comment: Res2)
R10  5k  [RESC1608X55X25ML10T15]
R11  15k  [RESC1608X55X25ML10T15]
R12  value 1K  [AXIAL-0.4]  (hidden comment: ?)
R13  value 1K  [AXIAL-0.4]  (hidden comment: ?)
R14  value 1K  [AXIAL-0.4]  (hidden comment: Res2)
R15  value 1K  [AXIAL-0.4]  (hidden comment: Res2)
R16  5k  [RESC1608X55X25ML10T15]
R17  15k  [RESC1608X55X25ML10T15]
U4  DRV8886  [PWP0024B_N]
U6  DRV8886  [PWP0024B_N]

### Ports
X_AOUT1 (out), X_AOUT2 (out), X_BOUT1 (out), X_BOUT2 (out), X_DIR (in), X_ENABLE (in), X_M0 (in), X_M1 (in), X_nFAULT (out), X_nSLEEP (in), X_STEP (in), Y_AOUT1 (out), Y_AOUT2 (out), Y_BOUT1 (out), Y_BOUT2 (out), Y_DIR (in), Y_ENABLE (in), Y_M0 (in), Y_M1 (in), Y_nFAULT (out), Y_nSLEEP (in), Y_STEP (in)

### Nets
3V3: R6.2 R7.2 R12.2 R13.2
GND: C3.2 C4.2 C5.1 C6.1 C9.2 C10.2 C11.1 C12.1 R8.1 R9.1 R11.1 R14.1 R15.1 R17.1 U4.6(PGND) U4.9(PGND) U4.12(GND) U4.25(PAD) U6.6(PGND) U6.9(PGND) U6.12(GND) U6.25(PAD)
X~{_}SLEEP: U4.17(SLEEP_N) ; port X_nSLEEP
X_AOUT1: J2.1 U4.5(AOUT1) ; port X_AOUT1
X_AOUT2: J2.2 U4.7(AOUT2) ; port X_AOUT2
X_BOUT1: J3.1 U4.10(BOUT1) ; port X_BOUT1
X_BOUT2: J3.2 U4.8(BOUT2) ; port X_BOUT2
X_CPH: C1.1 U4.2(CPH)
X_CPL: C1.2 U4.1(CPL)
X_Decay: R6.1 R8.2 U4.24(DECAY)
X_DIR: U4.20(DIR) ; port X_DIR
X_ENABLE: U4.18(ENABLE) ; port X_ENABLE
X_M0: U4.21(M0) ; port X_M0
X_M1: U4.22(M1) ; port X_M1
X_nFAULT: R10.2 U4.15(FAULT_N) ; port X_nFAULT
X_STEP: U4.19(STEP) ; port X_STEP
X_TRQ: R7.1 R9.2 U4.23(TRQ)
X_VCP: C2.2 U4.3(VCP)
X_VM: C2.1 C3.1 C4.1 U4.4(VM) U4.11(VM)
Y~{_}SLEEP: U6.17(SLEEP_N) ; port Y_nSLEEP
Y_AOUT1: J4.1 U6.5(AOUT1) ; port Y_AOUT1
Y_AOUT2: J4.2 U6.7(AOUT2) ; port Y_AOUT2
Y_BOUT1: J5.1 U6.10(BOUT1) ; port Y_BOUT1
Y_BOUT2: J5.2 U6.8(BOUT2) ; port Y_BOUT2
Y_CPH: C7.1 U6.2(CPH)
Y_CPL: C7.2 U6.1(CPL)
Y_Decay: R12.1 R14.2 U6.24(DECAY)
Y_DIR: U6.20(DIR) ; port Y_DIR
Y_ENABLE: U6.18(ENABLE) ; port Y_ENABLE
Y_M0: U6.21(M0) ; port Y_M0
Y_M1: U6.22(M1) ; port Y_M1
Y_nFAULT: R16.2 U6.15(FAULT_N) ; port Y_nFAULT
Y_STEP: U6.19(STEP) ; port Y_STEP
Y_TRQ: R13.1 R15.2 U6.23(TRQ)
Y_VCP: C8.2 U6.3(VCP)
Y_VM: C8.1 C9.1 C10.1 U6.4(VM) U6.11(VM)
NetC5_2: C5.2 U4.13(AVDD)
NetC6_2: C6.2 R10.1 U4.14(DVDD)
NetC11_2: C11.2 U6.13(AVDD)
NetC12_2: C12.2 R16.1 U6.14(DVDD)
NetR11_2: R11.2 U4.16(RREF)
NetR17_2: R17.2 U6.16(RREF)

### Notes on the sheet
- X Motor Driver
- Y Motor Driver

### Library data of the parts
C1 C7 = CMP-2006-03139-1: Part Number: C0603C223K4RACTU; Manufacturer: Kemet
C2 C8 = CMP-2000-05394-1: Cap Ceramic, 0.22 uF, +/- 10%, -55 to 125 degC, 2-Pin SMD (0603), RoHS, Tape and Reel; Manufacturer: TDK; PCN Part Number: MLCCPartNumberChange30/Nov/2012; Capacitance: 0.22µF; Other Names: 445-7408-1; Design Resources: 20WNon-IsolatedBuckLEDDriverUsingPLLNK460KG; Online Catalog: CSeries,GeneralPurpose; Kits: 445-9014-KIT-ND-KITMLCC100PF-22UF060310-50V445-9003-KIT-ND-KITCAPCERHICAPMLCCSMD445-173086-KIT-ND-C0402-2220X7R6.3-50V1,000PF-; Temperature Coefficient: X7R; Product Training Modules: CSeriesGeneralApplicationsSEAT,CCV,andTVCLDesignToolsGuidetoReplacinganElectrolyticCapacitorwithanMLCC; Voltage - Rated: 50V; Ratings: -; Lead Spacing: -; Package Description: 2-Pin Chip Capacitor, Body 1.7 x 0.9 mm; Datasheet URL: https://datasheet.ciiva.com/24218/c1608x7r1h224k080ab-264841-24218813.pdf; Applications: GeneralPurpose; Series: C; Manufacturer URL: http://www.tdk.com/; Size / Dimension: 0.063"Lx0.031"W(1.60mmx0.80mm); Features: -; Tolerance: ±10%; Package Reference: 603; Family: CeramicCapacitors; Standard Package: 1; RoHS Information: RoHSCertificate-MLCC; Thickness (Max): 0.035"(0.90mm); Package / Case: 0603(1608Metric); Operating Temperature: -55degC~125degC; Datasheet Version: Sep-13; Mounting Type: SurfaceMount,MLCC; Lead Style: -; Height - Seated (Max): -; Packaging: CutTape(CT); Category: Capacitors
C3 C4 C9 C10 = CMP-2006-03299-1: Manufacturer: Kemet; Part Number: C0603X103K5RACTU
C5 C6 C11 C12 = CMP-2006-04187-1: Part Number: 06033C474KAT2A; Manufacturer: AVX Interconnect / Elco
J2-J5 = CMP-1684-00017-1: Female Header, Pitch 5 mm, 1 x 2 Position, Height 10 mm, Tail Length 3.5 mm, Rohs, Bulk; Manufacturer: TE Connectivity; Wire Gauge: 16-30AWG; Product Training Modules: Wire-to-BoardEurostyleTerminalBlocks; Clamp Material - Plating: Brass-NickelPlated; Voltage: 300V; Mating Orientation: HorizontalwithBoard; Current: 13.5A; Pitch: 0.197"(5.00mm); Screw Thread: M3; 3D Model: 282836-2.pdf; Other Names: 5ULV-02B / A98076; Dynamic Catalog: BuchananSeries; Number of Levels: 1; Torque - Screw: 0.68Nm(6Lb-In); Featured Product: EurostyleTerminalBlockConnectors; Positions Per Level: 2; Wire Termination: Screw-RisingCageClamp; Datasheet URL: http://www.te.com.cn/commerce/DocumentDelivery/DDEController?Action=showdoc&DocId=Catalog+Section%7F1308389_EUROSTYLE_TERMINAL_BLOCKS%7F0607%7Fpdf%7FEnglish%7FENG_CS_1308389_EUROSTYLE_TERMINAL_BLOCKS_0607.pdf%7F282836-2; Color: Green; Family: TerminalBlocks-WiretoBoard; RoHS Information: 282836-2StatementofCompliance; Standard Package: 300; Contact Material - Plating: Brass-TinPlated; Manufacturer URL: http://www.te.com; Housing Material: Polyamide(PA66),Nylon6/6; Features: Interlocking(Side); Package Description: Female Header, Pitch 5 mm, 1 x 2 Position, Height 10 mm, Tail Length 3.5 mm; Mounting Type: ThroughHole; Package Reference: THD; Packaging: Bulk; Series: Buchanan; Category: Connectors,Interconnects; Screw Material - Plating: Brass-NickelPlated
R6-R9 R12-R15 = Res2: Resistor; Published: 8-Jun-2000; LatestRevisionDate: 17-Jul-2002; LatestRevisionNote: Re-released for DXP Platform.; PackageReference: AXIAL-0.4; Publisher: Altium Limited; PackageDescription: Axial Device, Thru-Hole; 2 Leads; 0.4 in Pin Spacing
R10 R11 R16 R17 = CMP-2100-03667-1: as R31 on sheet Memory_USB; Width: 0.8mm; Max Operating Temperature: 155degC; Tolerance: 5%; Package Reference: 0603; Height: 0.45mm; Depth: 0.8mm; Package Description: 2-Pin Surface Mount Device, Body 1.6 x 0.8 mm; Termination: SMD/SMT; Package Quantity: 5000; Case/Package: 0603; Case Code (Imperial): 0603; Radiation Hardening: No; Number of Pins: 2; Length: 1.6mm; Lead Free: LeadFree; Voltage Rating (DC): 50V; Military Standard: Not; Datasheet URL: http://www.yageo.com/NewPortal/yageodocoutput?fileName=/pdf/R-Chip/PYu-RC_Group_51_RoHS_L_5.pdf; Manufacturer URL: http://www.yageo.com/; Packaging: TapeandReel; Case Code (Metric): 1608; Min Operating Temperature: -55degC; Composition: ThickFilm; RoHSCompliant: true; Contact Plating: Tin; Datasheet Version: Rev. 5, 10/2016; REACH SVHC: NoSVHC

## Sheet Z_Extruder_Motor_Drivers.SchDoc
size A
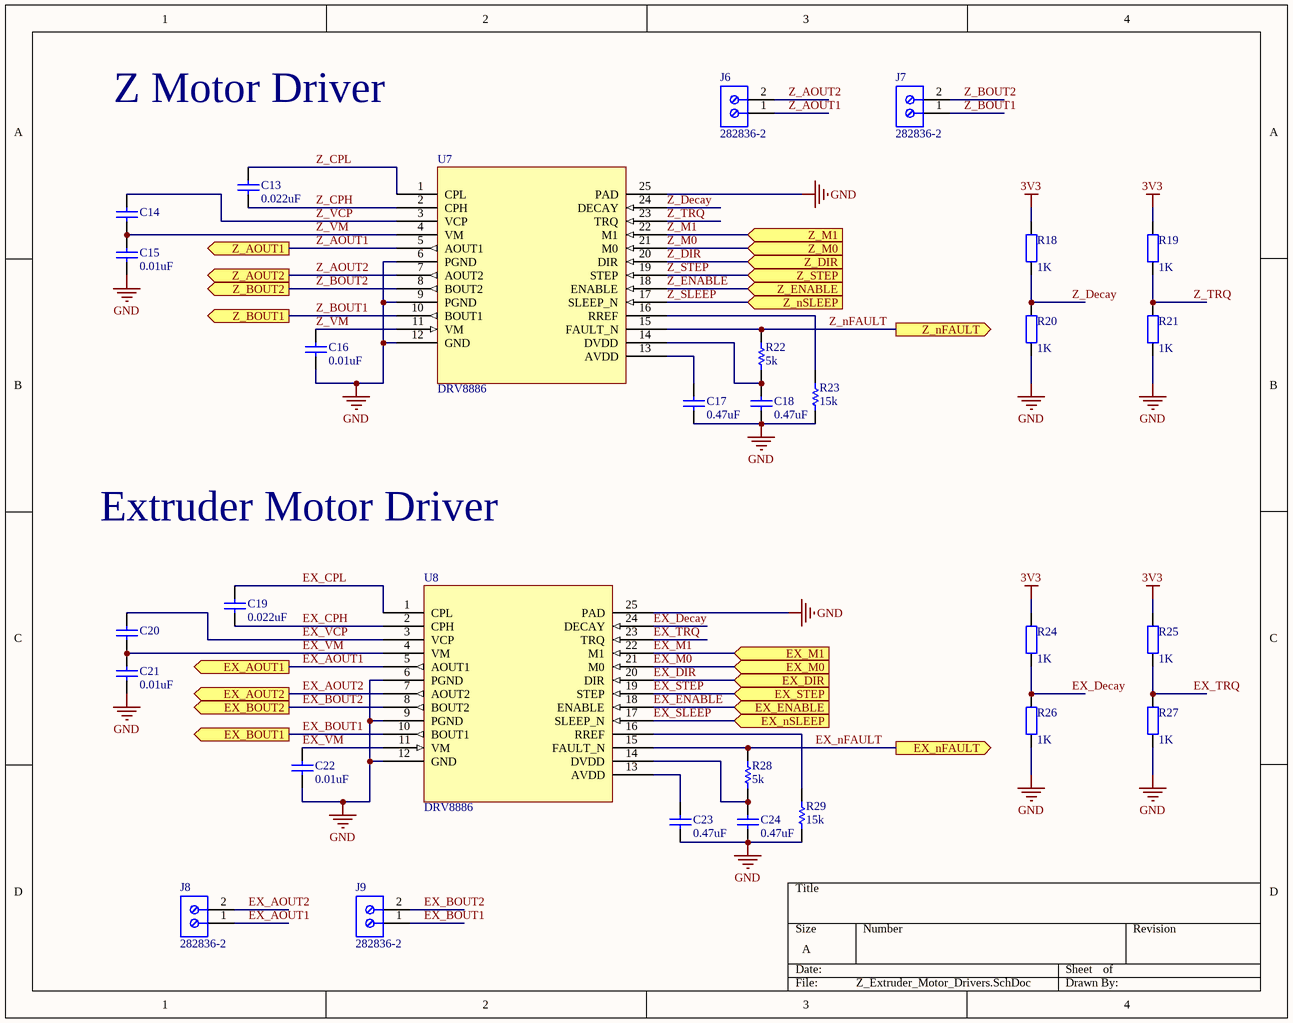
[diagram p4: Z_Extruder_Motor_Drivers.SchDoc]

### Parts
C13  0.022uF  [CAPC1608X87X35ML15T15]
C14  0.22uF  [TDK-C1608-2_A_M]  (value not drawn)
C15  0.01uF  [CAPC1608X87X35LL15T15]
C16  0.01uF  [CAPC1608X87X35LL15T15]
C17  0.47uF  [CAPC1608X90X35ML15T15]
C18  0.47uF  [CAPC1608X90X35ML15T15]
C19  0.022uF  [CAPC1608X87X35ML15T15]
C20  0.22uF  [TDK-C1608-2_A_M]  (value not drawn)
C21  0.01uF  [CAPC1608X87X35LL15T15]
C22  0.01uF  [CAPC1608X87X35LL15T15]
C23  0.47uF  [CAPC1608X90X35ML15T15]
C24  0.47uF  [CAPC1608X90X35ML15T15]
J6  282836-2  [TECO-282836-2_V]
J7  282836-2  [TECO-282836-2_V]
J8  282836-2  [TECO-282836-2_V]
J9  282836-2  [TECO-282836-2_V]
R18  value 1K  [AXIAL-0.4]  (hidden comment: ?)
R19  value 1K  [AXIAL-0.4]  (hidden comment: ?)
R20  value 1K  [AXIAL-0.4]  (hidden comment: Res2)
R21  value 1K  [AXIAL-0.4]  (hidden comment: Res2)
R22  5k  [RESC1608X55X25ML10T15]
R23  15k  [RESC1608X55X25ML10T15]
R24  value 1K  [AXIAL-0.4]  (hidden comment: ?)
R25  value 1K  [AXIAL-0.4]  (hidden comment: ?)
R26  value 1K  [AXIAL-0.4]  (hidden comment: Res2)
R27  value 1K  [AXIAL-0.4]  (hidden comment: Res2)
R28  5k  [RESC1608X55X25ML10T15]
R29  15k  [RESC1608X55X25ML10T15]
U7  DRV8886  [PWP0024B_N]
U8  DRV8886  [PWP0024B_N]

### Ports
EX_AOUT1 (out), EX_AOUT2 (out), EX_BOUT1 (out), EX_BOUT2 (out), EX_DIR (in), EX_ENABLE (in), EX_M0 (in), EX_M1 (in), EX_nFAULT (out), EX_nSLEEP (in), EX_STEP (in), Z_AOUT1 (out), Z_AOUT2 (out), Z_BOUT1 (out), Z_BOUT2 (out), Z_DIR (in), Z_ENABLE (in), Z_M0 (in), Z_M1 (in), Z_nFAULT (out), Z_nSLEEP (in), Z_STEP (in)

### Nets
3V3: R18.2 R19.2 R24.2 R25.2
GND: C15.2 C16.2 C17.1 C18.1 C21.2 C22.2 C23.1 C24.1 R20.1 R21.1 R23.1 R26.1 R27.1 R29.1 U7.6(PGND) U7.9(PGND) U7.12(GND) U7.25(PAD) U8.6(PGND) U8.9(PGND) U8.12(GND) U8.25(PAD)
EX~{_}SLEEP: U8.17(SLEEP_N) ; port EX_nSLEEP
EX_AOUT1: J8.1 U8.5(AOUT1) ; port EX_AOUT1
EX_AOUT2: J8.2 U8.7(AOUT2) ; port EX_AOUT2
EX_BOUT1: J9.1 U8.10(BOUT1) ; port EX_BOUT1
EX_BOUT2: J9.2 U8.8(BOUT2) ; port EX_BOUT2
EX_CPH: C19.1 U8.2(CPH)
EX_CPL: C19.2 U8.1(CPL)
EX_Decay: R24.1 R26.2 U8.24(DECAY)
EX_DIR: U8.20(DIR) ; port EX_DIR
EX_ENABLE: U8.18(ENABLE) ; port EX_ENABLE
EX_M0: U8.21(M0) ; port EX_M0
EX_M1: U8.22(M1) ; port EX_M1
EX_nFAULT: R28.2 U8.15(FAULT_N) ; port EX_nFAULT
EX_STEP: U8.19(STEP) ; port EX_STEP
EX_TRQ: R25.1 R27.2 U8.23(TRQ)
EX_VCP: C20.2 U8.3(VCP)
EX_VM: C20.1 C21.1 C22.1 U8.4(VM) U8.11(VM)
Z~{_}SLEEP: U7.17(SLEEP_N) ; port Z_nSLEEP
Z_AOUT1: J6.1 U7.5(AOUT1) ; port Z_AOUT1
Z_AOUT2: J6.2 U7.7(AOUT2) ; port Z_AOUT2
Z_BOUT1: J7.1 U7.10(BOUT1) ; port Z_BOUT1
Z_BOUT2: J7.2 U7.8(BOUT2) ; port Z_BOUT2
Z_CPH: C13.1 U7.2(CPH)
Z_CPL: C13.2 U7.1(CPL)
Z_Decay: R18.1 R20.2 U7.24(DECAY)
Z_DIR: U7.20(DIR) ; port Z_DIR
Z_ENABLE: U7.18(ENABLE) ; port Z_ENABLE
Z_M0: U7.21(M0) ; port Z_M0
Z_M1: U7.22(M1) ; port Z_M1
Z_nFAULT: R22.2 U7.15(FAULT_N) ; port Z_nFAULT
Z_STEP: U7.19(STEP) ; port Z_STEP
Z_TRQ: R19.1 R21.2 U7.23(TRQ)
Z_VCP: C14.2 U7.3(VCP)
Z_VM: C14.1 C15.1 C16.1 U7.4(VM) U7.11(VM)
NetC17_2: C17.2 U7.13(AVDD)
NetC18_2: C18.2 R22.1 U7.14(DVDD)
NetC23_2: C23.2 U8.13(AVDD)
NetC24_2: C24.2 R28.1 U8.14(DVDD)
NetR23_2: R23.2 U7.16(RREF)
NetR29_2: R29.2 U8.16(RREF)

### Notes on the sheet
- Z Motor Driver
- Extruder Motor Driver

### Library data of the parts
C13 C19 = CMP-2006-03139-1: as C1 on sheet X_Y_Motor_Drivers
C14 C20 = CMP-2000-05394-1: as C2 on sheet X_Y_Motor_Drivers; Ratings: -; Lead Spacing: -; Package Description: 2-Pin Chip Capacitor, Body 1.7 x 0.9 mm; Datasheet URL: https://datasheet.ciiva.com/24218/c1608x7r1h224k080ab-264841-24218813.pdf; Applications: GeneralPurpose; Series: C; Manufacturer URL: http://www.tdk.com/; Size / Dimension: 0.063"Lx0.031"W(1.60mmx0.80mm); Features: -; Tolerance: ±10%; Package Reference: 603; Family: CeramicCapacitors; Standard Package: 1; RoHS Information: RoHSCertificate-MLCC; Thickness (Max): 0.035"(0.90mm); Package / Case: 0603(1608Metric); Operating Temperature: -55degC~125degC; Datasheet Version: Sep-13; Mounting Type: SurfaceMount,MLCC; Lead Style: -; Height - Seated (Max): -; Packaging: CutTape(CT); Category: Capacitors
C15 C16 C21 C22 = CMP-2006-03299-1: as C3 on sheet X_Y_Motor_Drivers
C17 C18 C23 C24 = CMP-2006-04187-1: as C5 on sheet X_Y_Motor_Drivers
J6-J9 = CMP-1684-00017-1: as J2 on sheet X_Y_Motor_Drivers; Datasheet URL: http://www.te.com.cn/commerce/DocumentDelivery/DDEController?Action=showdoc&DocId=Catalog+Section%7F1308389_EUROSTYLE_TERMINAL_BLOCKS%7F0607%7Fpdf%7FEnglish%7FENG_CS_1308389_EUROSTYLE_TERMINAL_BLOCKS_0607.pdf%7F282836-2; Color: Green; Family: TerminalBlocks-WiretoBoard; RoHS Information: 282836-2StatementofCompliance; Standard Package: 300; Contact Material - Plating: Brass-TinPlated; Manufacturer URL: http://www.te.com; Housing Material: Polyamide(PA66),Nylon6/6; Features: Interlocking(Side); Package Description: Female Header, Pitch 5 mm, 1 x 2 Position, Height 10 mm, Tail Length 3.5 mm; Mounting Type: ThroughHole; Package Reference: THD; Packaging: Bulk; Series: Buchanan; Category: Connectors,Interconnects; Screw Material - Plating: Brass-NickelPlated
R18-R21 R24-R27 = Res2: Resistor; Published: 8-Jun-2000; LatestRevisionDate: 17-Jul-2002; LatestRevisionNote: Re-released for DXP Platform.; PackageReference: AXIAL-0.4; Publisher: Altium Limited; PackageDescription: Axial Device, Thru-Hole; 2 Leads; 0.4 in Pin Spacing
R22 R23 R28 R29 = CMP-2100-03667-1: as R31 on sheet Memory_USB; Width: 0.8mm; Max Operating Temperature: 155degC; Tolerance: 5%; Package Reference: 0603; Height: 0.45mm; Depth: 0.8mm; Package Description: 2-Pin Surface Mount Device, Body 1.6 x 0.8 mm; Termination: SMD/SMT; Package Quantity: 5000; Case/Package: 0603; Case Code (Imperial): 0603; Radiation Hardening: No; Number of Pins: 2; Length: 1.6mm; Lead Free: LeadFree; Voltage Rating (DC): 50V; Military Standard: Not; Datasheet URL: http://www.yageo.com/NewPortal/yageodocoutput?fileName=/pdf/R-Chip/PYu-RC_Group_51_RoHS_L_5.pdf; Manufacturer URL: http://www.yageo.com/; Packaging: TapeandReel; Case Code (Metric): 1608; Min Operating Temperature: -55degC; Composition: ThickFilm; RoHSCompliant: true; Contact Plating: Tin; Datasheet Version: Rev. 5, 10/2016; REACH SVHC: NoSVHC

## Sheet LCD.SchDoc
size A
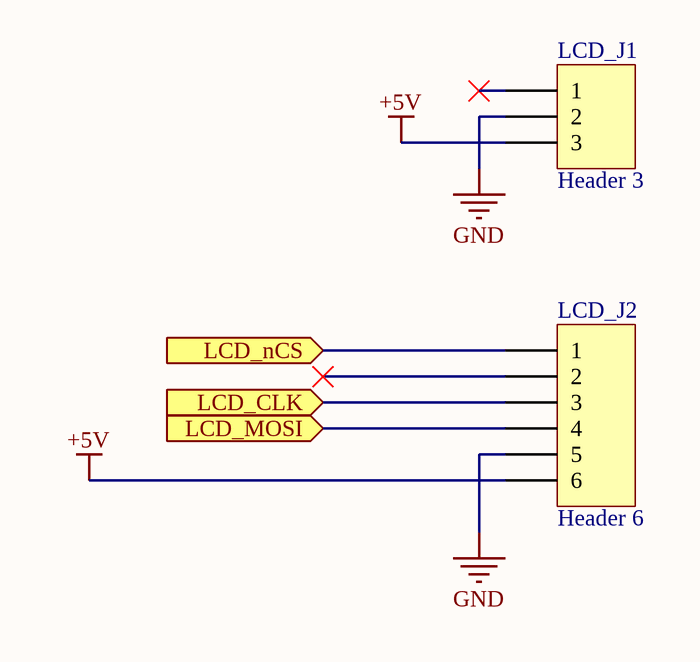
[diagram p5: LCD.SchDoc]

### Parts
LCD_J1  Header 3  [HDR1X3]
LCD_J2  Header 6  [HDR1X6]

### Ports
LCD_CLK (in), LCD_MOSI (in), LCD_nCS (in)

### Nets
+5V: LCD_J1.3 LCD_J2.6
GND: LCD_J1.2 LCD_J2.5
NetLCD_J2_1: LCD_J2.1 ; port LCD_nCS
NetLCD_J2_3: LCD_J2.3 ; port LCD_CLK
NetLCD_J2_4: LCD_J2.4 ; port LCD_MOSI

Not connected (* = marked no-connect by the designer): LCD_J1 1*; LCD_J2 2*

### Library data of the parts
LCD_J1 = Header 3: Header, 3-Pin; LatestRevisionDate: 17-Jul-2002; LatestRevisionNote: Re-released for DXP Platform.; Publisher: Altium Limited
LCD_J2 = Header 6: Header, 6-Pin; LatestRevisionDate: 17-Jul-2002; LatestRevisionNote: Re-released for DXP Platform.; Publisher: Altium Limited

## Nets that join several sheets
3V3: MCU (5 pins), Memory_USB (P1.6), X_Y_Motor_Drivers (R6.2 R7.2 R12.2 R13.2), Z_Extruder_Motor_Drivers (R18.2 R19.2 R24.2 R25.2)
+3V3: MCU (R30.2), Memory_USB (CD1.4 P3.1 R1.2 U5.8), Power (C47.1 R37.2 R40.2 U*1.5)
+5V: Memory_USB (J1.1 R31.2), Power (C44.1 U*.5), LCD (LCD_J1.3 LCD_J2.6)
GND: MCU (32 pins), Memory_USB (11 pins), Power (23 pins), X_Y_Motor_Drivers (22 pins), Z_Extruder_Motor_Drivers (22 pins), LCD (LCD_J1.2 LCD_J2.5)
EX~{_}SLEEP: MCU (U1.99), Z_Extruder_Motor_Drivers (U8.17)
EX_DIR: MCU (U1.97), Z_Extruder_Motor_Drivers (U8.20)
EX_ENABLE: MCU (U1.98), Z_Extruder_Motor_Drivers (U8.18)
EX_M0: MCU (U1.95), Z_Extruder_Motor_Drivers (U8.21)
EX_M1: MCU (U1.91), Z_Extruder_Motor_Drivers (U8.22)
EX_nFAULT: MCU (U1.100), Z_Extruder_Motor_Drivers (R28.2 U8.15)
EX_STEP: MCU (U1.96), Z_Extruder_Motor_Drivers (U8.19)
FLASH_Clk: MCU (U1.42), Memory_USB (P3.4 U5.6)
FLASH_MISO: MCU (U1.40), Memory_USB (P3.3 U5.2)
FLASH_MOSI: MCU (U1.41), Memory_USB (P3.2 U5.5)
FLASH_nCS: MCU (U1.43), Memory_USB (P3.5 U5.1)
NetJ1_2: MCU (U1.68), Memory_USB (J1.2)
NetJ1_3: MCU (U1.69), Memory_USB (J1.3)
NetLCD_J2_1: MCU (U1.29), LCD (LCD_J2.1)
NetLCD_J2_3: MCU (U1.28), LCD (LCD_J2.3)
NetLCD_J2_4: MCU (U1.31), LCD (LCD_J2.4)
NetR31_1: MCU (U1.71), Memory_USB (R31.1)
NetU1_78: MCU (U1.78), Power (U*.3)
NetU1_79: MCU (U1.79), Power (U*1.3)
SD_Clock: MCU (U1.49), Memory_USB (CD1.5 P1.3)
SD_Data_In: MCU (U1.46), Memory_USB (CD1.3 P1.4)
SD_Data_Out: MCU (U1.47), Memory_USB (CD1.7 P1.2)
SD_nCS: MCU (U1.48), Memory_USB (CD1.2 P1.5 R1.1)
X~{_}SLEEP: MCU (U1.15), X_Y_Motor_Drivers (U4.17)
X_DIR: MCU (U1.13), X_Y_Motor_Drivers (U4.20)
X_ENABLE: MCU (U1.14), X_Y_Motor_Drivers (U4.18)
X_M0: MCU (U1.12), X_Y_Motor_Drivers (U4.21)
X_M1: MCU (U1.11), X_Y_Motor_Drivers (U4.22)
X_nFAULT: MCU (U1.17), X_Y_Motor_Drivers (R10.2 U4.15)
X_STEP: MCU (U1.16), X_Y_Motor_Drivers (U4.19)
Y~{_}SLEEP: MCU (U1.26), X_Y_Motor_Drivers (U6.17)
Y_DIR: MCU (U1.23), X_Y_Motor_Drivers (U6.20)
Y_ENABLE: MCU (U1.24), X_Y_Motor_Drivers (U6.18)
Y_M0: MCU (U1.22), X_Y_Motor_Drivers (U6.21)
Y_M1: MCU (U1.19), X_Y_Motor_Drivers (U6.22)
Y_nFAULT: MCU (U1.27), X_Y_Motor_Drivers (R16.2 U6.15)
Y_STEP: MCU (U1.25), X_Y_Motor_Drivers (U6.19)
Z~{_}SLEEP: MCU (U1.72), Z_Extruder_Motor_Drivers (U7.17)
Z_DIR: MCU (U1.61), Z_Extruder_Motor_Drivers (U7.20)
Z_ENABLE: MCU (U1.62), Z_Extruder_Motor_Drivers (U7.18)
Z_M0: MCU (U1.60), Z_Extruder_Motor_Drivers (U7.21)
Z_M1: MCU (U1.58), Z_Extruder_Motor_Drivers (U7.22)
Z_nFAULT: MCU (U1.73), Z_Extruder_Motor_Drivers (R22.2 U7.15)
Z_STEP: MCU (U1.59), Z_Extruder_Motor_Drivers (U7.19)